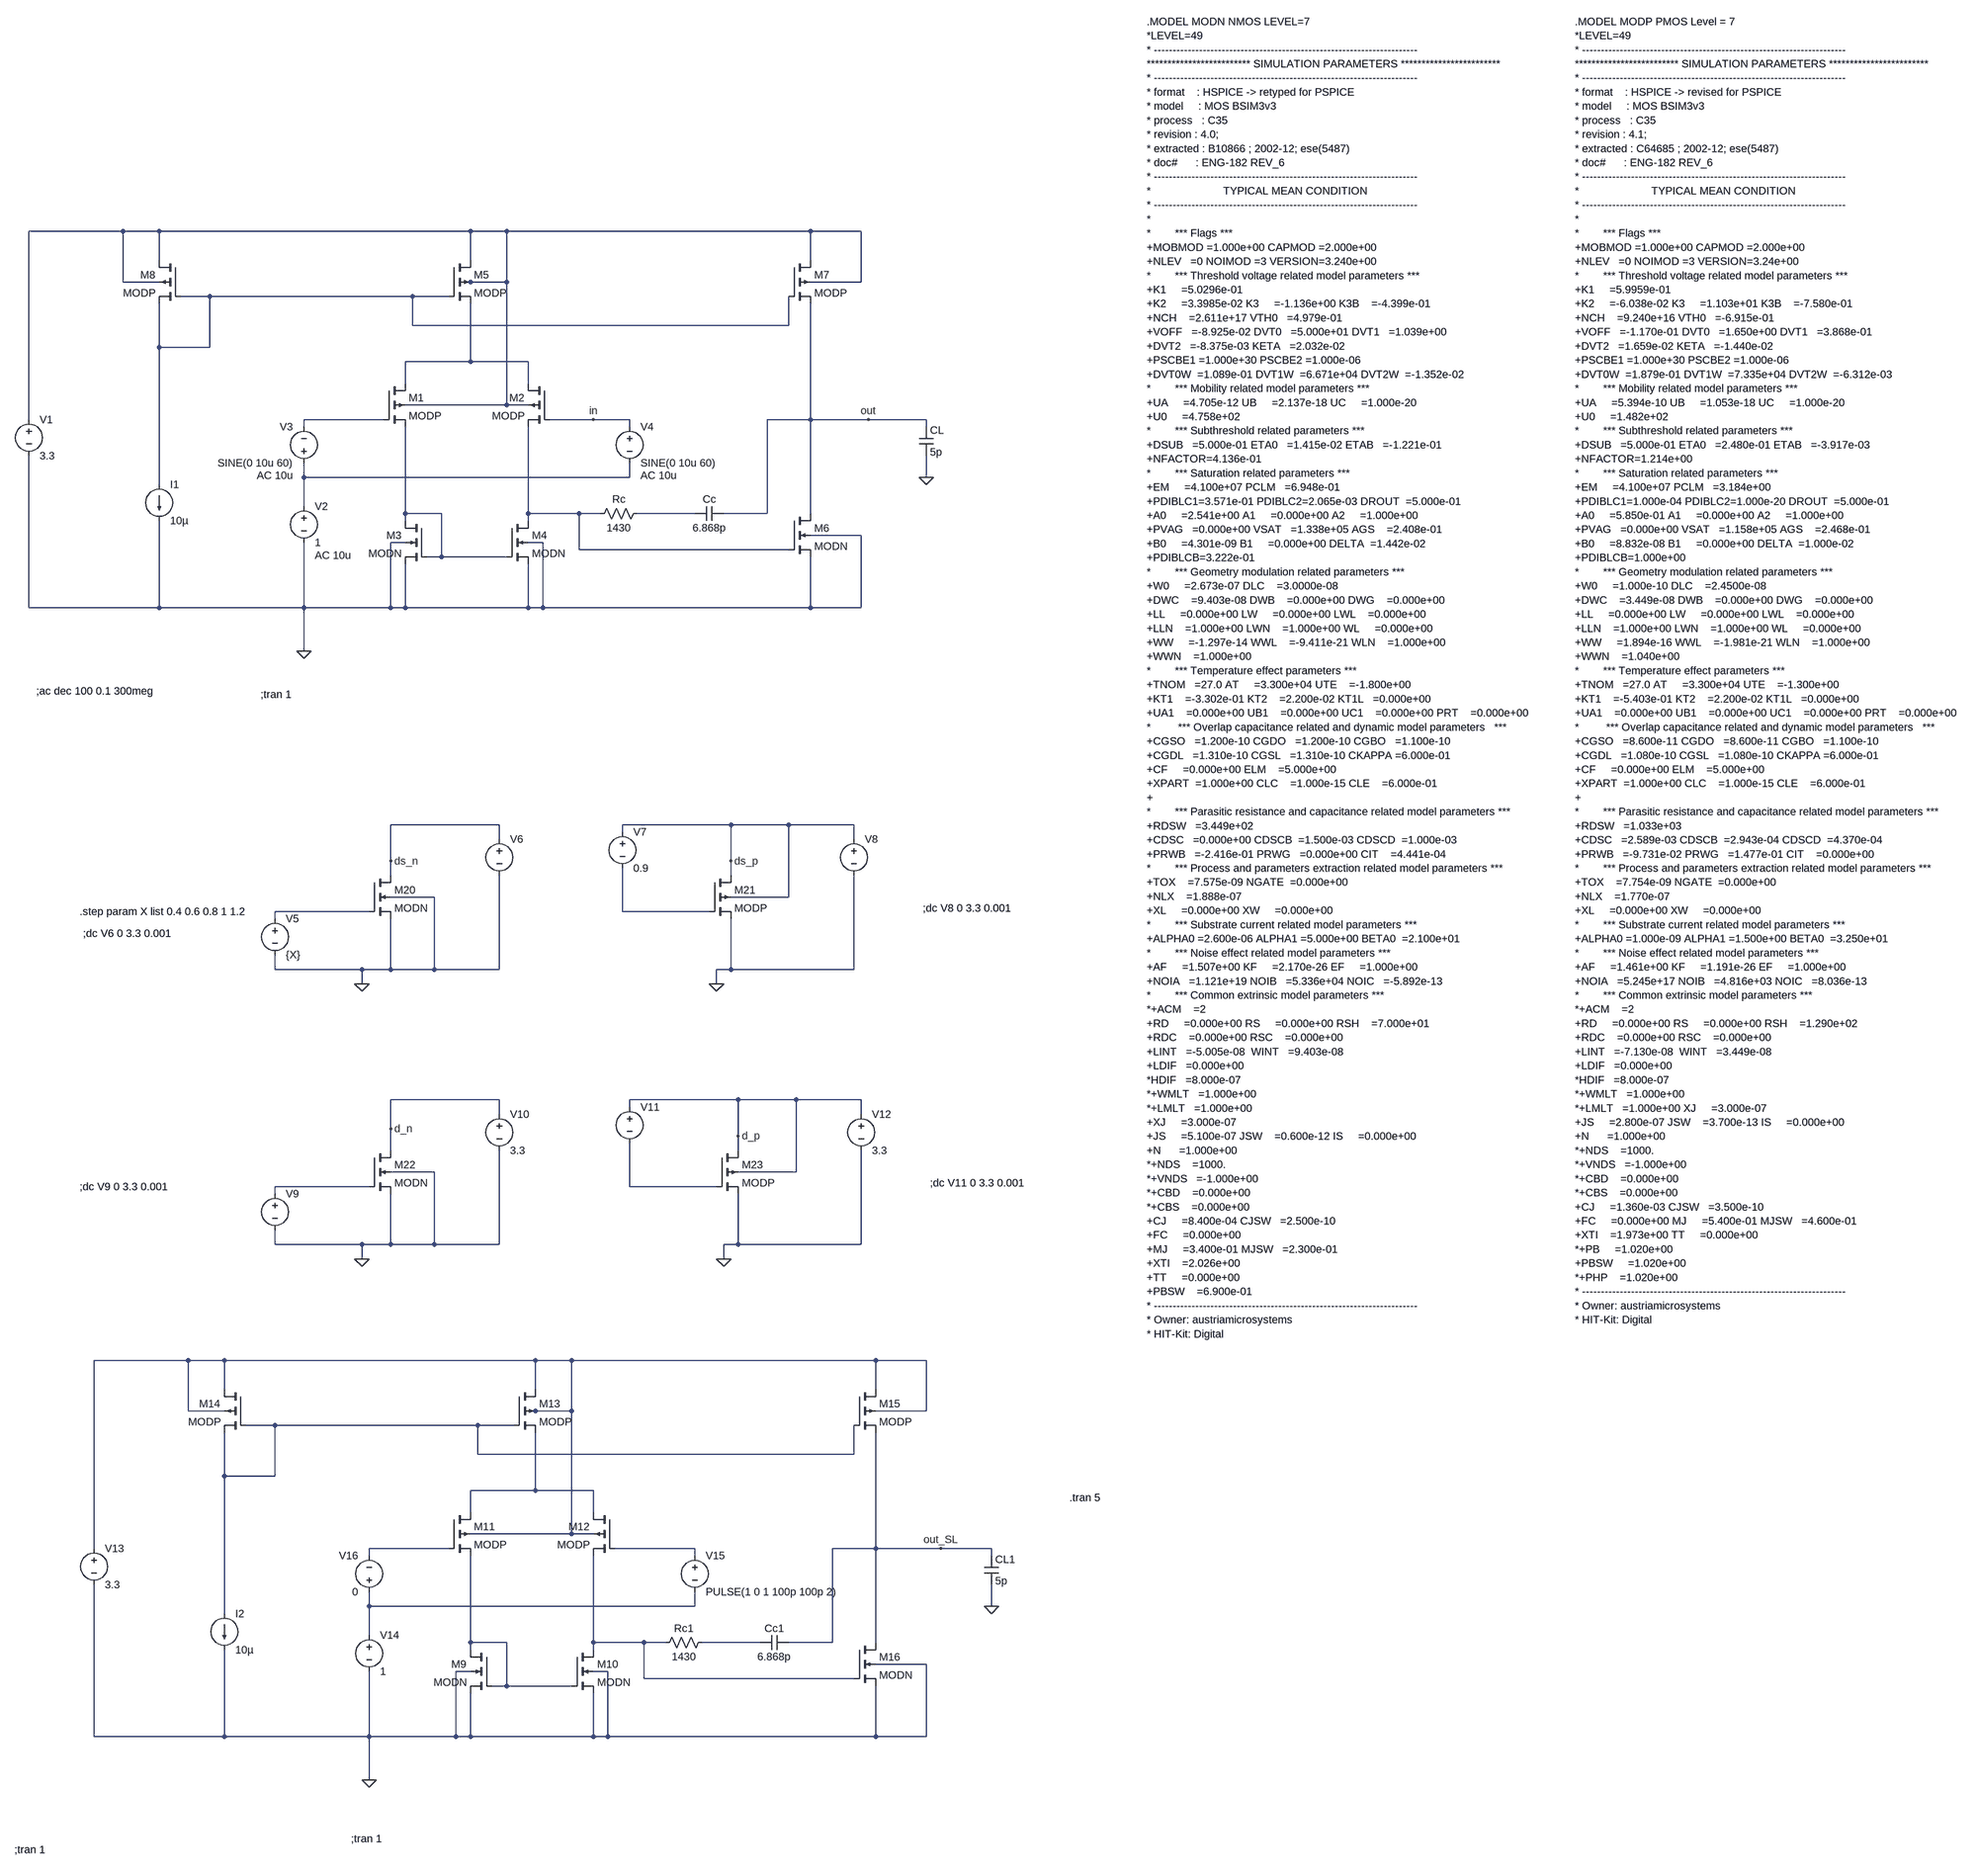
[diagram p0: schematic ota.asc]
ota.asc, the LTspice schematic file:
Version 4
SHEET 1 2732 4928
WIRE -1952 16 -2160 16
WIRE -1872 16 -1952 16
WIRE -1184 16 -1872 16
WIRE -1104 16 -1184 16
WIRE -432 16 -1104 16
WIRE -320 16 -432 16
WIRE -1872 80 -1872 16
WIRE -1184 80 -1184 16
WIRE -432 80 -432 16
WIRE -1952 128 -1952 16
WIRE -1872 128 -1952 128
WIRE -1184 128 -1200 128
WIRE -1104 128 -1104 16
WIRE -1104 128 -1184 128
WIRE -320 128 -320 16
WIRE -320 128 -432 128
WIRE -1760 160 -1824 160
WIRE -1312 160 -1760 160
WIRE -1232 160 -1312 160
WIRE -1312 224 -1312 160
WIRE -480 224 -480 160
WIRE -480 224 -1312 224
WIRE -1872 272 -1872 176
WIRE -1760 272 -1760 160
WIRE -1760 272 -1872 272
WIRE -1184 304 -1184 176
WIRE -1184 304 -1328 304
WIRE -1056 304 -1184 304
WIRE -1328 352 -1328 304
WIRE -1056 352 -1056 304
WIRE -1104 400 -1104 128
WIRE -1104 400 -1328 400
WIRE -1056 400 -1104 400
WIRE -2160 432 -2160 16
WIRE -1376 432 -1552 432
WIRE -912 432 -1008 432
WIRE -832 432 -912 432
WIRE -432 432 -432 176
WIRE -432 432 -528 432
WIRE -304 432 -432 432
WIRE -176 432 -304 432
WIRE -1552 448 -1552 432
WIRE -832 448 -832 432
WIRE -176 448 -176 432
WIRE -1552 560 -1552 528
WIRE -832 560 -832 528
WIRE -832 560 -1552 560
WIRE -176 560 -176 512
WIRE -1872 576 -1872 272
WIRE -1552 624 -1552 560
WIRE -1328 640 -1328 448
WIRE -1248 640 -1328 640
WIRE -1056 640 -1056 448
WIRE -944 640 -1056 640
WIRE -896 640 -944 640
WIRE -688 640 -816 640
WIRE -528 640 -528 432
WIRE -528 640 -624 640
WIRE -432 640 -432 432
WIRE -1328 656 -1328 640
WIRE -1056 656 -1056 640
WIRE -320 688 -432 688
WIRE -1328 704 -1360 704
WIRE -1024 704 -1056 704
WIRE -944 720 -944 640
WIRE -480 720 -944 720
WIRE -1248 736 -1248 640
WIRE -1248 736 -1280 736
WIRE -1104 736 -1248 736
WIRE -2160 848 -2160 512
WIRE -1872 848 -1872 656
WIRE -1872 848 -2160 848
WIRE -1552 848 -1552 704
WIRE -1552 848 -1872 848
WIRE -1360 848 -1360 704
WIRE -1360 848 -1552 848
WIRE -1328 848 -1328 752
WIRE -1328 848 -1360 848
WIRE -1056 848 -1056 752
WIRE -1056 848 -1328 848
WIRE -1024 848 -1024 704
WIRE -1024 848 -1056 848
WIRE -432 848 -432 736
WIRE -432 848 -1024 848
WIRE -320 848 -320 688
WIRE -320 848 -432 848
WIRE -1552 944 -1552 848
WIRE -1120 1328 -1360 1328
WIRE -608 1328 -848 1328
WIRE -480 1328 -608 1328
WIRE -336 1328 -480 1328
WIRE -848 1344 -848 1328
WIRE -1120 1360 -1120 1328
WIRE -336 1360 -336 1328
WIRE -1360 1408 -1360 1328
WIRE -608 1408 -608 1328
WIRE -1360 1440 -1360 1408
WIRE -608 1440 -608 1408
WIRE -1264 1488 -1360 1488
WIRE -480 1488 -480 1328
WIRE -480 1488 -608 1488
WIRE -1408 1520 -1616 1520
WIRE -848 1520 -848 1424
WIRE -656 1520 -848 1520
WIRE -1616 1536 -1616 1520
WIRE -1616 1648 -1616 1616
WIRE -1424 1648 -1616 1648
WIRE -1360 1648 -1360 1536
WIRE -1360 1648 -1424 1648
WIRE -1264 1648 -1264 1488
WIRE -1264 1648 -1360 1648
WIRE -1120 1648 -1120 1440
WIRE -1120 1648 -1264 1648
WIRE -608 1648 -608 1536
WIRE -608 1648 -640 1648
WIRE -336 1648 -336 1440
WIRE -336 1648 -608 1648
WIRE -1424 1680 -1424 1648
WIRE -640 1680 -640 1648
WIRE -1120 1936 -1360 1936
WIRE -592 1936 -832 1936
WIRE -464 1936 -592 1936
WIRE -320 1936 -464 1936
WIRE -832 1952 -832 1936
WIRE -1120 1968 -1120 1936
WIRE -320 1968 -320 1936
WIRE -1360 2000 -1360 1936
WIRE -592 2016 -592 1936
WIRE -1360 2048 -1360 2000
WIRE -592 2048 -592 2016
WIRE -1264 2096 -1360 2096
WIRE -464 2096 -464 1936
WIRE -464 2096 -592 2096
WIRE -1408 2128 -1616 2128
WIRE -832 2128 -832 2032
WIRE -640 2128 -832 2128
WIRE -1616 2144 -1616 2128
WIRE -1616 2256 -1616 2224
WIRE -1424 2256 -1616 2256
WIRE -1360 2256 -1360 2144
WIRE -1360 2256 -1424 2256
WIRE -1264 2256 -1264 2096
WIRE -1264 2256 -1360 2256
WIRE -1120 2256 -1120 2048
WIRE -1120 2256 -1264 2256
WIRE -592 2256 -592 2144
WIRE -592 2256 -624 2256
WIRE -320 2256 -320 2048
WIRE -320 2256 -592 2256
WIRE -1424 2288 -1424 2256
WIRE -624 2288 -624 2256
WIRE -1808 2512 -2016 2512
WIRE -1728 2512 -1808 2512
WIRE -1040 2512 -1728 2512
WIRE -960 2512 -1040 2512
WIRE -288 2512 -960 2512
WIRE -176 2512 -288 2512
WIRE -1728 2576 -1728 2512
WIRE -1040 2576 -1040 2512
WIRE -288 2576 -288 2512
WIRE -1808 2624 -1808 2512
WIRE -1728 2624 -1808 2624
WIRE -1040 2624 -1056 2624
WIRE -960 2624 -960 2512
WIRE -960 2624 -1040 2624
WIRE -176 2624 -176 2512
WIRE -176 2624 -288 2624
WIRE -1616 2656 -1680 2656
WIRE -1168 2656 -1616 2656
WIRE -1088 2656 -1168 2656
WIRE -1168 2720 -1168 2656
WIRE -336 2720 -336 2656
WIRE -336 2720 -1168 2720
WIRE -1728 2768 -1728 2672
WIRE -1616 2768 -1616 2656
WIRE -1616 2768 -1728 2768
WIRE -1040 2800 -1040 2672
WIRE -1040 2800 -1184 2800
WIRE -912 2800 -1040 2800
WIRE -1184 2848 -1184 2800
WIRE -912 2848 -912 2800
WIRE -960 2896 -960 2624
WIRE -960 2896 -1184 2896
WIRE -912 2896 -960 2896
WIRE -2016 2928 -2016 2512
WIRE -1232 2928 -1408 2928
WIRE -688 2928 -864 2928
WIRE -288 2928 -288 2672
WIRE -288 2928 -384 2928
WIRE -144 2928 -288 2928
WIRE -32 2928 -144 2928
WIRE -1408 2944 -1408 2928
WIRE -688 2944 -688 2928
WIRE -32 2944 -32 2928
WIRE -1408 3056 -1408 3024
WIRE -688 3056 -688 3024
WIRE -688 3056 -1408 3056
WIRE -32 3056 -32 3008
WIRE -1728 3072 -1728 2768
WIRE -1408 3120 -1408 3056
WIRE -1184 3136 -1184 2944
WIRE -1104 3136 -1184 3136
WIRE -912 3136 -912 2944
WIRE -800 3136 -912 3136
WIRE -752 3136 -800 3136
WIRE -544 3136 -672 3136
WIRE -384 3136 -384 2928
WIRE -384 3136 -480 3136
WIRE -288 3136 -288 2928
WIRE -1184 3152 -1184 3136
WIRE -912 3152 -912 3136
WIRE -176 3184 -288 3184
WIRE -1184 3200 -1216 3200
WIRE -880 3200 -912 3200
WIRE -800 3216 -800 3136
WIRE -336 3216 -800 3216
WIRE -1104 3232 -1104 3136
WIRE -1104 3232 -1136 3232
WIRE -960 3232 -1104 3232
WIRE -2016 3344 -2016 3008
WIRE -1728 3344 -1728 3152
WIRE -1728 3344 -2016 3344
WIRE -1408 3344 -1408 3200
WIRE -1408 3344 -1728 3344
WIRE -1216 3344 -1216 3200
WIRE -1216 3344 -1408 3344
WIRE -1184 3344 -1184 3248
WIRE -1184 3344 -1216 3344
WIRE -912 3344 -912 3248
WIRE -912 3344 -1184 3344
WIRE -880 3344 -880 3200
WIRE -880 3344 -912 3344
WIRE -288 3344 -288 3232
WIRE -288 3344 -880 3344
WIRE -176 3344 -176 3184
WIRE -176 3344 -288 3344
WIRE -1408 3440 -1408 3344
FLAG -176 560 0
FLAG -1552 944 0
FLAG -1360 1408 ds_n
FLAG -1424 1680 0
FLAG -640 1680 0
FLAG -608 1408 ds_p
FLAG -1424 2288 0
FLAG -1360 2000 d_n
FLAG -624 2288 0
FLAG -592 2016 d_p
FLAG -304 432 out
FLAG -912 432 in
FLAG -32 3056 0
FLAG -1408 3440 0
FLAG -144 2928 out_SL
SYMBOL voltage -2160 416 R0
WINDOW 123 0 0 Left 0
WINDOW 39 0 0 Left 0
SYMATTR InstName V1
SYMATTR Value 3.3
SYMBOL nmos4 -1280 656 M0
SYMATTR InstName M3
SYMATTR Value MODN
SYMATTR Value2 l=1.4u w=19.523u
SYMBOL nmos4 -1104 656 R0
SYMATTR InstName M4
SYMATTR Value MODN
SYMATTR Value2 l=1.4u w=19.523u
SYMBOL pmos4 -1376 352 R0
SYMATTR InstName M1
SYMATTR Value MODP
SYMATTR Value2 l=1.4u w=82.77u
SYMBOL pmos4 -1008 352 M0
SYMATTR InstName M2
SYMATTR Value MODP
SYMATTR Value2 l=1.4u w=82.77u
SYMBOL pmos4 -1232 80 R0
SYMATTR InstName M5
SYMATTR Value MODP
SYMATTR Value2 l=1.4u w=165.5395u
SYMBOL pmos4 -1824 80 M0
SYMATTR InstName M8
SYMATTR Value MODP
SYMATTR Value2 l=1.4u w=23.649u
SYMBOL current -1872 576 R0
WINDOW 123 0 0 Left 0
WINDOW 39 0 0 Left 0
SYMATTR InstName I1
SYMATTR Value 10µ
SYMBOL pmos4 -480 80 R0
SYMATTR InstName M7
SYMATTR Value MODP
SYMATTR Value2 l=1.4u w=165.5395u
SYMBOL nmos4 -480 640 R0
SYMATTR InstName M6
SYMATTR Value MODN
SYMATTR Value2 l=1.4u w=39.0425u
SYMBOL cap -192 448 R0
SYMATTR InstName CL
SYMATTR Value 5p
SYMATTR SpiceLine V=25 Irms=0 Rser=0 Lser=0 mfg="Murata" pn="GCM0335C1E5R0CA16" type="C0G"
SYMBOL voltage -1552 608 R0
WINDOW 123 24 124 Left 2
WINDOW 39 0 0 Left 0
SYMATTR Value2 AC 10u
SYMATTR InstName V2
SYMATTR Value 1
SYMBOL voltage -1552 544 R180
WINDOW 0 24 96 Left 2
WINDOW 3 24 16 Left 2
WINDOW 123 24 -12 Left 2
WINDOW 39 0 0 Left 0
SYMATTR InstName V3
SYMATTR Value SINE(0 10u 60)
SYMATTR Value2 AC 10u
SYMBOL voltage -832 432 R0
WINDOW 123 24 124 Left 2
WINDOW 39 0 0 Left 0
SYMATTR Value2 AC 10u
SYMATTR InstName V4
SYMATTR Value SINE(0 10u 60)
SYMBOL res -800 624 R90
WINDOW 0 0 56 VBottom 2
WINDOW 3 32 56 VTop 2
SYMATTR InstName Rc
SYMATTR Value 1430
SYMBOL cap -624 624 R90
WINDOW 0 0 32 VBottom 2
WINDOW 3 32 32 VTop 2
SYMATTR InstName Cc
SYMATTR Value 6.868p
SYMBOL nmos4 -1408 1440 R0
SYMATTR InstName M20
SYMATTR Value MODN
SYMATTR Value2 l=1.4u w=1.4u
SYMBOL voltage -1616 1520 R0
WINDOW 123 0 0 Left 0
WINDOW 39 0 0 Left 0
SYMATTR InstName V5
SYMATTR Value {X}
SYMBOL voltage -1120 1344 R0
WINDOW 123 0 0 Left 0
WINDOW 39 0 0 Left 0
SYMATTR InstName V6
SYMATTR Value ""
SYMBOL pmos4 -656 1440 R0
SYMATTR InstName M21
SYMATTR Value2 l=1.4u w=1.4u
SYMATTR Value MODP
SYMBOL voltage -848 1328 R0
WINDOW 123 0 0 Left 0
WINDOW 39 0 0 Left 0
SYMATTR InstName V7
SYMATTR Value 0.9
SYMBOL voltage -336 1344 R0
WINDOW 123 0 0 Left 0
WINDOW 39 0 0 Left 0
SYMATTR InstName V8
SYMATTR Value ""
SYMBOL nmos4 -1408 2048 R0
SYMATTR InstName M22
SYMATTR Value MODN
SYMATTR Value2 l=1.4u w=1.4u
SYMBOL voltage -1616 2128 R0
WINDOW 123 0 0 Left 0
WINDOW 39 0 0 Left 0
SYMATTR InstName V9
SYMATTR Value ""
SYMBOL voltage -1120 1952 R0
WINDOW 123 0 0 Left 0
WINDOW 39 0 0 Left 0
SYMATTR InstName V10
SYMATTR Value 3.3
SYMBOL pmos4 -640 2048 R0
SYMATTR InstName M23
SYMATTR Value2 l=1.4u w=1.4u
SYMATTR Value MODP
SYMBOL voltage -832 1936 R0
WINDOW 123 0 0 Left 0
WINDOW 39 0 0 Left 0
SYMATTR InstName V11
SYMATTR Value ""
SYMBOL voltage -320 1952 R0
WINDOW 123 0 0 Left 0
WINDOW 39 0 0 Left 0
SYMATTR InstName V12
SYMATTR Value 3.3
SYMBOL voltage -2016 2912 R0
WINDOW 123 0 0 Left 0
WINDOW 39 0 0 Left 0
SYMATTR InstName V13
SYMATTR Value 3.3
SYMBOL nmos4 -1136 3152 M0
SYMATTR InstName M9
SYMATTR Value MODN
SYMATTR Value2 l=1.4u w=19.523u
SYMBOL nmos4 -960 3152 R0
SYMATTR InstName M10
SYMATTR Value MODN
SYMATTR Value2 l=1.4u w=19.523u
SYMBOL pmos4 -1232 2848 R0
SYMATTR InstName M11
SYMATTR Value MODP
SYMATTR Value2 l=1.4u w=82.77u
SYMBOL pmos4 -864 2848 M0
SYMATTR InstName M12
SYMATTR Value MODP
SYMATTR Value2 l=1.4u w=82.77u
SYMBOL pmos4 -1088 2576 R0
SYMATTR InstName M13
SYMATTR Value MODP
SYMATTR Value2 l=1.4u w=165.5395u
SYMBOL pmos4 -1680 2576 M0
SYMATTR InstName M14
SYMATTR Value MODP
SYMATTR Value2 l=1.4u w=23.649u
SYMBOL current -1728 3072 R0
WINDOW 123 0 0 Left 0
WINDOW 39 0 0 Left 0
SYMATTR InstName I2
SYMATTR Value 10µ
SYMBOL pmos4 -336 2576 R0
SYMATTR InstName M15
SYMATTR Value MODP
SYMATTR Value2 l=1.4u w=165.5395u
SYMBOL nmos4 -336 3136 R0
SYMATTR InstName M16
SYMATTR Value MODN
SYMATTR Value2 l=1.4u w=39.0425u
SYMBOL cap -48 2944 R0
SYMATTR InstName CL1
SYMATTR Value 5p
SYMATTR SpiceLine V=25 Irms=0 Rser=0 Lser=0 mfg="Murata" pn="GCM0335C1E5R0CA16" type="C0G"
SYMBOL voltage -1408 3104 R0
WINDOW 123 24 124 Left 2
WINDOW 39 0 0 Left 0
SYMATTR InstName V14
SYMATTR Value 1
SYMBOL res -656 3120 R90
WINDOW 0 0 56 VBottom 2
WINDOW 3 32 56 VTop 2
SYMATTR InstName Rc1
SYMATTR Value 1430
SYMBOL cap -480 3120 R90
WINDOW 0 0 32 VBottom 2
WINDOW 3 32 32 VTop 2
SYMATTR InstName Cc1
SYMATTR Value 6.868p
SYMBOL voltage -688 2928 R0
WINDOW 123 0 0 Left 0
WINDOW 39 0 0 Left 0
SYMATTR InstName V15
SYMATTR Value PULSE(1 0 1 100p 100p 2)
SYMBOL voltage -1408 3040 R180
WINDOW 0 24 96 Left 2
WINDOW 3 24 16 Left 2
WINDOW 123 0 0 Left 0
WINDOW 39 0 0 Left 0
SYMATTR InstName V16
SYMATTR Value 0
TEXT -1448 4888 Left 2 !;tran 1
TEXT 496 -448 Left 2 !.MODEL MODN NMOS LEVEL=7\n*LEVEL=49 \n* ----------------------------------------------------------------------\n************************* SIMULATION PARAMETERS ************************\n* ----------------------------------------------------------------------\n* format    : HSPICE -> retyped for PSPICE\n* model     : MOS BSIM3v3\n* process   : C35\n* revision : 4.0; \n* extracted : B10866 ; 2002-12; ese(5487)\n* doc#      : ENG-182 REV_6\n* ----------------------------------------------------------------------\n*                        TYPICAL MEAN CONDITION\n* ----------------------------------------------------------------------\n*\n*        *** Flags ***\n+MOBMOD =1.000e+00 CAPMOD =2.000e+00 \n+NLEV   =0 NOIMOD =3 VERSION=3.240e+00 \n*        *** Threshold voltage related model parameters ***\n+K1     =5.0296e-01 \n+K2     =3.3985e-02 K3     =-1.136e+00 K3B    =-4.399e-01 \n+NCH    =2.611e+17 VTH0   =4.979e-01 \n+VOFF   =-8.925e-02 DVT0   =5.000e+01 DVT1   =1.039e+00 \n+DVT2   =-8.375e-03 KETA   =2.032e-02 \n+PSCBE1 =1.000e+30 PSCBE2 =1.000e-06 \n+DVT0W  =1.089e-01 DVT1W  =6.671e+04 DVT2W  =-1.352e-02 \n*        *** Mobility related model parameters ***\n+UA     =4.705e-12 UB     =2.137e-18 UC     =1.000e-20 \n+U0     =4.758e+02 \n*        *** Subthreshold related parameters ***\n+DSUB   =5.000e-01 ETA0   =1.415e-02 ETAB   =-1.221e-01 \n+NFACTOR=4.136e-01 \n*        *** Saturation related parameters ***\n+EM     =4.100e+07 PCLM   =6.948e-01 \n+PDIBLC1=3.571e-01 PDIBLC2=2.065e-03 DROUT  =5.000e-01 \n+A0     =2.541e+00 A1     =0.000e+00 A2     =1.000e+00 \n+PVAG   =0.000e+00 VSAT   =1.338e+05 AGS    =2.408e-01 \n+B0     =4.301e-09 B1     =0.000e+00 DELTA  =1.442e-02 \n+PDIBLCB=3.222e-01 \n*        *** Geometry modulation related parameters ***\n+W0     =2.673e-07 DLC    =3.0000e-08 \n+DWC    =9.403e-08 DWB    =0.000e+00 DWG    =0.000e+00 \n+LL     =0.000e+00 LW     =0.000e+00 LWL    =0.000e+00 \n+LLN    =1.000e+00 LWN    =1.000e+00 WL     =0.000e+00 \n+WW     =-1.297e-14 WWL    =-9.411e-21 WLN    =1.000e+00 \n+WWN    =1.000e+00 \n*        *** Temperature effect parameters ***\n+TNOM   =27.0 AT     =3.300e+04 UTE    =-1.800e+00 \n+KT1    =-3.302e-01 KT2    =2.200e-02 KT1L   =0.000e+00 \n+UA1    =0.000e+00 UB1    =0.000e+00 UC1    =0.000e+00 PRT    =0.000e+00 \n*         *** Overlap capacitance related and dynamic model parameters   ***\n+CGSO   =1.200e-10 CGDO   =1.200e-10 CGBO   =1.100e-10 \n+CGDL   =1.310e-10 CGSL   =1.310e-10 CKAPPA =6.000e-01 \n+CF     =0.000e+00 ELM    =5.000e+00 \n+XPART  =1.000e+00 CLC    =1.000e-15 CLE    =6.000e-01 \n+\n*        *** Parasitic resistance and capacitance related model parameters ***\n+RDSW   =3.449e+02 \n+CDSC   =0.000e+00 CDSCB  =1.500e-03 CDSCD  =1.000e-03 \n+PRWB   =-2.416e-01 PRWG   =0.000e+00 CIT    =4.441e-04 \n*        *** Process and parameters extraction related model parameters ***\n+TOX    =7.575e-09 NGATE  =0.000e+00 \n+NLX    =1.888e-07 \n+XL     =0.000e+00 XW     =0.000e+00 \n*        *** Substrate current related model parameters ***\n+ALPHA0 =2.600e-06 ALPHA1 =5.000e+00 BETA0  =2.100e+01 \n*        *** Noise effect related model parameters ***\n+AF     =1.507e+00 KF     =2.170e-26 EF     =1.000e+00 \n+NOIA   =1.121e+19 NOIB   =5.336e+04 NOIC   =-5.892e-13 \n*        *** Common extrinsic model parameters ***\n*+ACM    =2        \n+RD     =0.000e+00 RS     =0.000e+00 RSH    =7.000e+01 \n+RDC    =0.000e+00 RSC    =0.000e+00 \n+LINT   =-5.005e-08  WINT   =9.403e-08 \n+LDIF   =0.000e+00 \n*HDIF   =8.000e-07\n*+WMLT   =1.000e+00 \n*+LMLT   =1.000e+00 \n+XJ     =3.000e-07 \n+JS     =5.100e-07 JSW    =0.600e-12 IS     =0.000e+00 \n+N      =1.000e+00 \n*+NDS    =1000. \n*+VNDS   =-1.000e+00 \n*+CBD    =0.000e+00 \n*+CBS    =0.000e+00 \n+CJ     =8.400e-04 CJSW   =2.500e-10 \n+FC     =0.000e+00 \n+MJ     =3.400e-01 MJSW   =2.300e-01 \n+XTI    =2.026e+00 \n+TT     =0.000e+00 \n+PBSW    =6.900e-01 \n* ----------------------------------------------------------------------\n* Owner: austriamicrosystems\n* HIT-Kit: Digital
TEXT 1680 -448 Left 2 !.MODEL MODP PMOS Level = 7\n*LEVEL=49 \n* ----------------------------------------------------------------------\n************************* SIMULATION PARAMETERS ************************\n* ----------------------------------------------------------------------\n* format    : HSPICE -> revised for PSPICE\n* model     : MOS BSIM3v3\n* process   : C35\n* revision : 4.1; \n* extracted : C64685 ; 2002-12; ese(5487)\n* doc#      : ENG-182 REV_6\n* ----------------------------------------------------------------------\n*                        TYPICAL MEAN CONDITION\n* ----------------------------------------------------------------------\n*\n*        *** Flags ***\n+MOBMOD =1.000e+00 CAPMOD =2.000e+00 \n+NLEV   =0 NOIMOD =3 VERSION=3.24e+00 \n*        *** Threshold voltage related model parameters ***\n+K1     =5.9959e-01 \n+K2     =-6.038e-02 K3     =1.103e+01 K3B    =-7.580e-01 \n+NCH    =9.240e+16 VTH0   =-6.915e-01 \n+VOFF   =-1.170e-01 DVT0   =1.650e+00 DVT1   =3.868e-01 \n+DVT2   =1.659e-02 KETA   =-1.440e-02 \n+PSCBE1 =1.000e+30 PSCBE2 =1.000e-06 \n+DVT0W  =1.879e-01 DVT1W  =7.335e+04 DVT2W  =-6.312e-03 \n*        *** Mobility related model parameters ***\n+UA     =5.394e-10 UB     =1.053e-18 UC     =1.000e-20 \n+U0     =1.482e+02 \n*        *** Subthreshold related parameters ***\n+DSUB   =5.000e-01 ETA0   =2.480e-01 ETAB   =-3.917e-03 \n+NFACTOR=1.214e+00 \n*        *** Saturation related parameters ***\n+EM     =4.100e+07 PCLM   =3.184e+00 \n+PDIBLC1=1.000e-04 PDIBLC2=1.000e-20 DROUT  =5.000e-01 \n+A0     =5.850e-01 A1     =0.000e+00 A2     =1.000e+00 \n+PVAG   =0.000e+00 VSAT   =1.158e+05 AGS    =2.468e-01 \n+B0     =8.832e-08 B1     =0.000e+00 DELTA  =1.000e-02 \n+PDIBLCB=1.000e+00 \n*        *** Geometry modulation related parameters ***\n+W0     =1.000e-10 DLC    =2.4500e-08 \n+DWC    =3.449e-08 DWB    =0.000e+00 DWG    =0.000e+00 \n+LL     =0.000e+00 LW     =0.000e+00 LWL    =0.000e+00 \n+LLN    =1.000e+00 LWN    =1.000e+00 WL     =0.000e+00 \n+WW     =1.894e-16 WWL    =-1.981e-21 WLN    =1.000e+00 \n+WWN    =1.040e+00 \n*        *** Temperature effect parameters ***\n+TNOM   =27.0 AT     =3.300e+04 UTE    =-1.300e+00 \n+KT1    =-5.403e-01 KT2    =2.200e-02 KT1L   =0.000e+00 \n+UA1    =0.000e+00 UB1    =0.000e+00 UC1    =0.000e+00 PRT    =0.000e+00 \n*         *** Overlap capacitance related and dynamic model parameters   ***\n+CGSO   =8.600e-11 CGDO   =8.600e-11 CGBO   =1.100e-10 \n+CGDL   =1.080e-10 CGSL   =1.080e-10 CKAPPA =6.000e-01 \n+CF     =0.000e+00 ELM    =5.000e+00 \n+XPART  =1.000e+00 CLC    =1.000e-15 CLE    =6.000e-01 \n+\n*        *** Parasitic resistance and capacitance related model parameters ***\n+RDSW   =1.033e+03 \n+CDSC   =2.589e-03 CDSCB  =2.943e-04 CDSCD  =4.370e-04 \n+PRWB   =-9.731e-02 PRWG   =1.477e-01 CIT    =0.000e+00 \n*        *** Process and parameters extraction related model parameters ***\n+TOX    =7.754e-09 NGATE  =0.000e+00 \n+NLX    =1.770e-07 \n+XL     =0.000e+00 XW     =0.000e+00 \n*        *** Substrate current related model parameters ***\n+ALPHA0 =1.000e-09 ALPHA1 =1.500e+00 BETA0  =3.250e+01 \n*        *** Noise effect related model parameters ***\n+AF     =1.461e+00 KF     =1.191e-26 EF     =1.000e+00 \n+NOIA   =5.245e+17 NOIB   =4.816e+03 NOIC   =8.036e-13 \n*        *** Common extrinsic model parameters ***\n*+ACM    =2        \n+RD     =0.000e+00 RS     =0.000e+00 RSH    =1.290e+02 \n+RDC    =0.000e+00 RSC    =0.000e+00 \n+LINT   =-7.130e-08  WINT   =3.449e-08 \n+LDIF   =0.000e+00\n*HDIF   =8.000e-07 \n*+WMLT   =1.000e+00 \n*+LMLT   =1.000e+00 XJ     =3.000e-07 \n+JS     =2.800e-07 JSW    =3.700e-13 IS     =0.000e+00 \n+N      =1.000e+00 \n*+NDS    =1000. \n*+VNDS   =-1.000e+00 \n*+CBD    =0.000e+00 \n*+CBS    =0.000e+00 \n+CJ     =1.360e-03 CJSW   =3.500e-10 \n+FC     =0.000e+00 MJ     =5.400e-01 MJSW   =4.600e-01 \n+XTI    =1.973e+00 TT     =0.000e+00 \n*+PB     =1.020e+00 \n+PBSW     =1.020e+00\n*+PHP    =1.020e+00 \n* ----------------------------------------------------------------------\n* Owner: austriamicrosystems\n* HIT-Kit: Digital
TEXT -2048 1520 Left 2 !.step param X list 0.4 0.6 0.8 1 1.2
TEXT -2192 4912 Left 2 !;tran 1
TEXT -2040 1568 Left 2 !;dc V6 0 3.3 0.001
TEXT -184 1512 Left 2 !;dc V8 0 3.3 0.001
TEXT -2048 2128 Left 2 !;dc V9 0 3.3 0.001
TEXT -168 2120 Left 2 !;dc V11 0 3.3 0.001
TEXT -2144 1032 Left 2 !;ac dec 100 0.1 300meg
TEXT -1648 1040 Left 2 !;tran 1
TEXT 184 2816 Left 2 !.tran 5

The netlist it stands for:
* ota.asc
V1 N001 0 3.3
M3 N006 N006 0 0 MODN l=1.4u w=19.523u
M4 N007 N006 0 0 MODN l=1.4u w=19.523u
M1 N003 N004 N006 N001 MODP l=1.4u w=82.77u
M2 N003 in N007 N001 MODP l=1.4u w=82.77u
M5 N001 N002 N003 N001 MODP l=1.4u w=165.5395u
M8 N001 N002 N002 N001 MODP l=1.4u w=23.649u
I1 N002 0 10µ
M7 N001 N002 out N001 MODP l=1.4u w=165.5395u
M6 out N007 0 0 MODN l=1.4u w=39.0425u
CL out 0 5p V=25 Irms=0 Rser=0 Lser=0 mfg="Murata" pn="GCM0335C1E5R0CA16" type="C0G"
V2 N005 0 1 AC 10u
V3 N005 N004 SINE(0 10u 60) AC 10u
V4 in N005 SINE(0 10u 60) AC 10u
Rc N008 N007 1430
Cc out N008 6.868p
M20 ds_n N009 0 0 MODN l=1.4u w=1.4u
V5 N009 0 {X}
V6 ds_n 0
M21 ds_p N010 0 ds_p MODP l=1.4u w=1.4u
V7 ds_p N010 0.9
V8 ds_p 0
M22 d_n N011 0 0 MODN l=1.4u w=1.4u
V9 N011 0
V10 d_n 0 3.3
M23 d_p N012 0 d_p MODP l=1.4u w=1.4u
V11 d_p N012
V12 d_p 0 3.3
V13 N013 0 3.3
M9 N019 N019 0 0 MODN l=1.4u w=19.523u
M10 N020 N019 0 0 MODN l=1.4u w=19.523u
M11 N015 N016 N019 N013 MODP l=1.4u w=82.77u
M12 N015 N017 N020 N013 MODP l=1.4u w=82.77u
M13 N013 N014 N015 N013 MODP l=1.4u w=165.5395u
M14 N013 N014 N014 N013 MODP l=1.4u w=23.649u
I2 N014 0 10µ
M15 N013 N014 out_SL N013 MODP l=1.4u w=165.5395u
M16 out_SL N020 0 0 MODN l=1.4u w=39.0425u
CL1 out_SL 0 5p V=25 Irms=0 Rser=0 Lser=0 mfg="Murata" pn="GCM0335C1E5R0CA16" type="C0G"
V14 N018 0 1
Rc1 N021 N020 1430
Cc1 out_SL N021 6.868p
V15 N017 N018 PULSE(1 0 1 100p 100p 2)
V16 N018 N016 0
.model NMOS NMOS
.model PMOS PMOS
.lib standard.mos
;tran 1
.MODEL MODN NMOS LEVEL=7
*LEVEL=49
* ----------------------------------------------------------------------
************************* SIMULATION PARAMETERS ************************
* ----------------------------------------------------------------------
* format    : HSPICE -> retyped for PSPICE
* model     : MOS BSIM3v3
* process   : C35
* revision : 4.0;
* extracted : B10866 ; 2002-12; ese(5487)
* doc#      : ENG-182 REV_6
* ----------------------------------------------------------------------
*                        TYPICAL MEAN CONDITION
* ----------------------------------------------------------------------
*
*        *** Flags ***
+MOBMOD =1.000e+00 CAPMOD =2.000e+00
+NLEV   =0 NOIMOD =3 VERSION=3.240e+00
*        *** Threshold voltage related model parameters ***
+K1     =5.0296e-01
+K2     =3.3985e-02 K3     =-1.136e+00 K3B    =-4.399e-01
+NCH    =2.611e+17 VTH0   =4.979e-01
+VOFF   =-8.925e-02 DVT0   =5.000e+01 DVT1   =1.039e+00
+DVT2   =-8.375e-03 KETA   =2.032e-02
+PSCBE1 =1.000e+30 PSCBE2 =1.000e-06
+DVT0W  =1.089e-01 DVT1W  =6.671e+04 DVT2W  =-1.352e-02
*        *** Mobility related model parameters ***
+UA     =4.705e-12 UB     =2.137e-18 UC     =1.000e-20
+U0     =4.758e+02
*        *** Subthreshold related parameters ***
+DSUB   =5.000e-01 ETA0   =1.415e-02 ETAB   =-1.221e-01
+NFACTOR=4.136e-01
*        *** Saturation related parameters ***
+EM     =4.100e+07 PCLM   =6.948e-01
+PDIBLC1=3.571e-01 PDIBLC2=2.065e-03 DROUT  =5.000e-01
+A0     =2.541e+00 A1     =0.000e+00 A2     =1.000e+00
+PVAG   =0.000e+00 VSAT   =1.338e+05 AGS    =2.408e-01
+B0     =4.301e-09 B1     =0.000e+00 DELTA  =1.442e-02
+PDIBLCB=3.222e-01
*        *** Geometry modulation related parameters ***
+W0     =2.673e-07 DLC    =3.0000e-08
+DWC    =9.403e-08 DWB    =0.000e+00 DWG    =0.000e+00
+LL     =0.000e+00 LW     =0.000e+00 LWL    =0.000e+00
+LLN    =1.000e+00 LWN    =1.000e+00 WL     =0.000e+00
+WW     =-1.297e-14 WWL    =-9.411e-21 WLN    =1.000e+00
+WWN    =1.000e+00
*        *** Temperature effect parameters ***
+TNOM   =27.0 AT     =3.300e+04 UTE    =-1.800e+00
+KT1    =-3.302e-01 KT2    =2.200e-02 KT1L   =0.000e+00
+UA1    =0.000e+00 UB1    =0.000e+00 UC1    =0.000e+00 PRT    =0.000e+00
*         *** Overlap capacitance related and dynamic model parameters   ***
+CGSO   =1.200e-10 CGDO   =1.200e-10 CGBO   =1.100e-10
+CGDL   =1.310e-10 CGSL   =1.310e-10 CKAPPA =6.000e-01
+CF     =0.000e+00 ELM    =5.000e+00
+XPART  =1.000e+00 CLC    =1.000e-15 CLE    =6.000e-01
+
*        *** Parasitic resistance and capacitance related model parameters ***
+RDSW   =3.449e+02
+CDSC   =0.000e+00 CDSCB  =1.500e-03 CDSCD  =1.000e-03
+PRWB   =-2.416e-01 PRWG   =0.000e+00 CIT    =4.441e-04
*        *** Process and parameters extraction related model parameters ***
+TOX    =7.575e-09 NGATE  =0.000e+00
+NLX    =1.888e-07
+XL     =0.000e+00 XW     =0.000e+00
*        *** Substrate current related model parameters ***
+ALPHA0 =2.600e-06 ALPHA1 =5.000e+00 BETA0  =2.100e+01
*        *** Noise effect related model parameters ***
+AF     =1.507e+00 KF     =2.170e-26 EF     =1.000e+00
+NOIA   =1.121e+19 NOIB   =5.336e+04 NOIC   =-5.892e-13
*        *** Common extrinsic model parameters ***
*+ACM    =2
+RD     =0.000e+00 RS     =0.000e+00 RSH    =7.000e+01
+RDC    =0.000e+00 RSC    =0.000e+00
+LINT   =-5.005e-08  WINT   =9.403e-08
+LDIF   =0.000e+00
*HDIF   =8.000e-07
*+WMLT   =1.000e+00
*+LMLT   =1.000e+00
+XJ     =3.000e-07
+JS     =5.100e-07 JSW    =0.600e-12 IS     =0.000e+00
+N      =1.000e+00
*+NDS    =1000.
*+VNDS   =-1.000e+00
*+CBD    =0.000e+00
*+CBS    =0.000e+00
+CJ     =8.400e-04 CJSW   =2.500e-10
+FC     =0.000e+00
+MJ     =3.400e-01 MJSW   =2.300e-01
+XTI    =2.026e+00
+TT     =0.000e+00
+PBSW    =6.900e-01
* ----------------------------------------------------------------------
* Owner: austriamicrosystems
* HIT-Kit: Digital
.MODEL MODP PMOS Level = 7
*LEVEL=49
* ----------------------------------------------------------------------
************************* SIMULATION PARAMETERS ************************
* ----------------------------------------------------------------------
* format    : HSPICE -> revised for PSPICE
* model     : MOS BSIM3v3
* process   : C35
* revision : 4.1;
* extracted : C64685 ; 2002-12; ese(5487)
* doc#      : ENG-182 REV_6
* ----------------------------------------------------------------------
*                        TYPICAL MEAN CONDITION
* ----------------------------------------------------------------------
*
*        *** Flags ***
+MOBMOD =1.000e+00 CAPMOD =2.000e+00
+NLEV   =0 NOIMOD =3 VERSION=3.24e+00
*        *** Threshold voltage related model parameters ***
+K1     =5.9959e-01
+K2     =-6.038e-02 K3     =1.103e+01 K3B    =-7.580e-01
+NCH    =9.240e+16 VTH0   =-6.915e-01
+VOFF   =-1.170e-01 DVT0   =1.650e+00 DVT1   =3.868e-01
+DVT2   =1.659e-02 KETA   =-1.440e-02
+PSCBE1 =1.000e+30 PSCBE2 =1.000e-06
+DVT0W  =1.879e-01 DVT1W  =7.335e+04 DVT2W  =-6.312e-03
*        *** Mobility related model parameters ***
+UA     =5.394e-10 UB     =1.053e-18 UC     =1.000e-20
+U0     =1.482e+02
*        *** Subthreshold related parameters ***
+DSUB   =5.000e-01 ETA0   =2.480e-01 ETAB   =-3.917e-03
+NFACTOR=1.214e+00
*        *** Saturation related parameters ***
+EM     =4.100e+07 PCLM   =3.184e+00
+PDIBLC1=1.000e-04 PDIBLC2=1.000e-20 DROUT  =5.000e-01
+A0     =5.850e-01 A1     =0.000e+00 A2     =1.000e+00
+PVAG   =0.000e+00 VSAT   =1.158e+05 AGS    =2.468e-01
+B0     =8.832e-08 B1     =0.000e+00 DELTA  =1.000e-02
+PDIBLCB=1.000e+00
*        *** Geometry modulation related parameters ***
+W0     =1.000e-10 DLC    =2.4500e-08
+DWC    =3.449e-08 DWB    =0.000e+00 DWG    =0.000e+00
+LL     =0.000e+00 LW     =0.000e+00 LWL    =0.000e+00
+LLN    =1.000e+00 LWN    =1.000e+00 WL     =0.000e+00
+WW     =1.894e-16 WWL    =-1.981e-21 WLN    =1.000e+00
+WWN    =1.040e+00
*        *** Temperature effect parameters ***
+TNOM   =27.0 AT     =3.300e+04 UTE    =-1.300e+00
+KT1    =-5.403e-01 KT2    =2.200e-02 KT1L   =0.000e+00
+UA1    =0.000e+00 UB1    =0.000e+00 UC1    =0.000e+00 PRT    =0.000e+00
*         *** Overlap capacitance related and dynamic model parameters   ***
+CGSO   =8.600e-11 CGDO   =8.600e-11 CGBO   =1.100e-10
+CGDL   =1.080e-10 CGSL   =1.080e-10 CKAPPA =6.000e-01
+CF     =0.000e+00 ELM    =5.000e+00
+XPART  =1.000e+00 CLC    =1.000e-15 CLE    =6.000e-01
+
*        *** Parasitic resistance and capacitance related model parameters ***
+RDSW   =1.033e+03
+CDSC   =2.589e-03 CDSCB  =2.943e-04 CDSCD  =4.370e-04
+PRWB   =-9.731e-02 PRWG   =1.477e-01 CIT    =0.000e+00
*        *** Process and parameters extraction related model parameters ***
+TOX    =7.754e-09 NGATE  =0.000e+00
+NLX    =1.770e-07
+XL     =0.000e+00 XW     =0.000e+00
*        *** Substrate current related model parameters ***
+ALPHA0 =1.000e-09 ALPHA1 =1.500e+00 BETA0  =3.250e+01
*        *** Noise effect related model parameters ***
+AF     =1.461e+00 KF     =1.191e-26 EF     =1.000e+00
+NOIA   =5.245e+17 NOIB   =4.816e+03 NOIC   =8.036e-13
*        *** Common extrinsic model parameters ***
*+ACM    =2
+RD     =0.000e+00 RS     =0.000e+00 RSH    =1.290e+02
+RDC    =0.000e+00 RSC    =0.000e+00
+LINT   =-7.130e-08  WINT   =3.449e-08
+LDIF   =0.000e+00
*HDIF   =8.000e-07
*+WMLT   =1.000e+00
*+LMLT   =1.000e+00 XJ     =3.000e-07
+JS     =2.800e-07 JSW    =3.700e-13 IS     =0.000e+00
+N      =1.000e+00
*+NDS    =1000.
*+VNDS   =-1.000e+00
*+CBD    =0.000e+00
*+CBS    =0.000e+00
+CJ     =1.360e-03 CJSW   =3.500e-10
+FC     =0.000e+00 MJ     =5.400e-01 MJSW   =4.600e-01
+XTI    =1.973e+00 TT     =0.000e+00
*+PB     =1.020e+00
+PBSW     =1.020e+00
*+PHP    =1.020e+00
* ----------------------------------------------------------------------
* Owner: austriamicrosystems
* HIT-Kit: Digital
.step param X list 0.4 0.6 0.8 1 1.2
;tran 1
;dc V6 0 3.3 0.001
;dc V8 0 3.3 0.001
;dc V9 0 3.3 0.001
;dc V11 0 3.3 0.001
;ac dec 100 0.1 300meg
;tran 1
.tran 5
.backanno
.end